# Altium schematic sheet [4]_MOT_POWER.SchDoc
size A3; DocumentNumber: 4; SheetNumber: 4; SheetTotal: 12; Ngu?i ki?m tra: bangdd; Ngu?i thi?t k?: thannt114
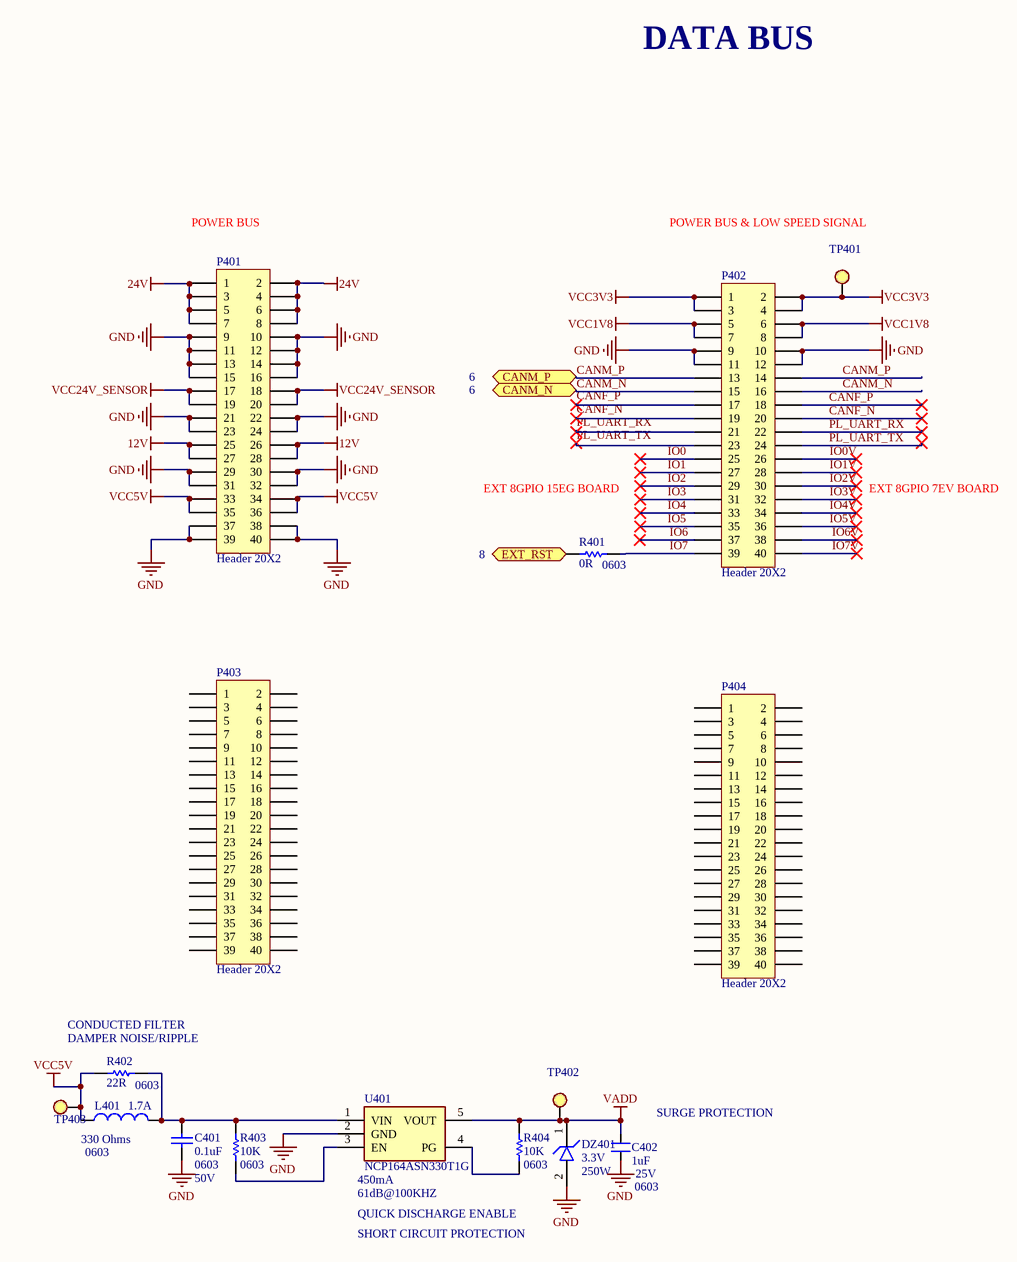
[diagram p0: [4]_MOT_POWER.SchDoc]

## Parts
C401  FOOTPRINT: 0603  Voltage: 50V  [CAP 0603]  (hidden comment: 0.1uF)
C402  PCB FOOTPRINT: 0603  Voltage: 25V  [CAP 0603]  (hidden comment: 1uF)
DZ401  Voltage - Reverse Standoff: 3.3V  Power - Peak Pulse: 250W  [SOD-323]  (hidden comment: ESD8351HT1G)
L401  PCB Footprint: 0603  Current: 1.7A  [FB 0603]  (hidden comment: 330 Ohms)
P401  Header 20X2  [SAMTEC_SSQ-120-03-G-D]
P402  Header 20X2  [SAMTEC_SSQ-120-03-G-D]
P403  Header 20X2  [SAMTEC_SSQ-120-03-G-D]
P404  Header 20X2  [SAMTEC_SSQ-120-03-G-D]
R401  PCB Footprint: 0603  [res 0603]  (hidden comment: 0R)  (no BOM)
R402  PCB Footprint: 0603  [res 0603]  (hidden comment: 22R)
R403  PCB Footprint: 0603  [res 0603]  (hidden comment: 10K)
R404  PCB Footprint: 0603  [res 0603]  (hidden comment: 10K)
TP401  TP SMD  [TESTPOINT]  (value not drawn)  (no BOM)
TP402  TP SMD  [TESTPOINT]  (value not drawn)  (no BOM)
TP403  TP SMD  [TESTPOINT]  (value not drawn)  (no BOM)
U401  NCP164ASN330T1G  CURRENT: 450mA  PSRR: 61dB@100KHZ  [SOT23-5]

## Ports
CANM_N (bidir, see 6), CANM_P (bidir, see 6), EXT_RST (bidir, see 8)

## Nets
12V: P401.25 P401.26 P401.27 P401.28
24V: P401.1 P401.2 P401.3 P401.4 P401.5 P401.6 P401.7 P401.8
GND: C401.1 C402.2 DZ401.2 P401.9 P401.10 P401.11 P401.12 P401.13 P401.14 P401.15 P401.16 P401.21 P401.22 P401.23 P401.24 P401.29 P401.30 P401.31 P401.32 P401.37 P401.38 P401.39 P401.40 P402.9 P402.10 P402.11 P402.12 U401.2(GND)
VADD: C402.1 DZ401.1 R404.1 TP402.1 U401.5(VOUT)
VCC1V8: P402.5 P402.6 P402.7 P402.8
VCC3V3: P402.1 P402.2 P402.3 P402.4 TP401.1
VCC5V: L401.1 P401.33 P401.34 P401.35 P401.36 R402.1 TP403.1
VCC24V_SENSOR: P401.17 P401.18 P401.19 P401.20
CANF_N: P402.19 P402.20
CANF_P: P402.17 P402.18
CANM_N: P402.15 P402.16 ; port CANM_N
CANM_P: P402.13 P402.14 ; port CANM_P
EXT_RST: R401.1 ; port EXT_RST
IO0: P402.25
IO0V: P402.26
IO1: P402.27
IO1V: P402.28
IO2: P402.29
IO2V: P402.30
IO3: P402.31
IO3V: P402.32
IO4: P402.33
IO4V: P402.34
IO5: P402.35
IO5V: P402.36
IO6: P402.37
IO6V: P402.38
IO7: P402.39 R401.2
IO7V: P402.40
PL_UART_RX: P402.21 P402.22
PL_UART_TX: P402.23 P402.24
NetC401_2: C401.2 L401.2 R402.2 R403.1 U401.1(VIN)
NetR403_2: R403.2 U401.3(EN)
NetR404_2: R404.2 U401.4(PG)

Not connected (* = marked no-connect by the designer): P403 1 2 3 4 5 6 7 8 9 10 11 12 13 14 15 16 17 18 19 20 21 22 23 24 25 26 27 28 29 30 31 32 33 34 35 36 37 38 39 40; P404 1 2 3 4 5 6 7 8 9 10 11 12 13 14 15 16 17 18 19 20 21 22 23 24 25 26 27 28 29 30 31 32 33 34 35 36 37 38 39 40

## Notes on the sheet
- DATA BUS
- (near P401) POWER BUS
- POWER BUS & LOW SPEED SIGNAL
- EXT 8GPIO 15EG BOARD
- EXT 8GPIO 7EV BOARD
- (near R402) CONDUCTED FILTER
- (near R402) DAMPER NOISE/RIPPLE
- (near C402) SURGE PROTECTION
- QUICK DISCHARGE ENABLE
- SHORT CIRCUIT PROTECTION

## Library data of the parts
C401 = Cap: CAP-CER,SMD;0.1UF,10%,50V,X7R,0603; MANUFACTURER1: Samsung Electro-Mechanics; MANUFACTURER1_PART#: CL10B104KB8NNNC; MANUFACTURER2_PART#: M0603X104K050TAX; MANUFACTURER1: SS; Unit: PCS; PACKING: Tape & Reel (TR); Process Type: SM; CATEGORY: CAP-CER; VALUE: 0.1uF; Material: X7R; PCB FOOTPRINT: 0603; Tolerance: ±10%; MANUFACTURER2: UWA
C402 = Cap_1uF: CAP CER 1UF 25V X7R 0603; MANUFACTURER1: Samsung Electro-Mechanics; MANUFACTURER1_PART#: CL10A105KA8NNNC; MANUFACTURER2_PART#: TMK107B7105KA-T; PACKING: TR; UNIT: PCS; Material: X5R; Process Type: SM; Tolerance: 10%; Value: 1uF; CATEGORY: CAP CER; PCB_ Footprint: 0603; MANUFACTURER2: Taiyo Yuden; LOH_Code: *
DZ401 = TVS-DIODE;BI-DIR,600W,30V/48.4V,DO214AA,SMBJ30A-E3/52: TVS DIODE 3.3VWM 11.2VC SOD323; MANUFACTURER1: onsemi; Category: TVS; MANUFACTURER1_PART#: ESD8351HT1G; VALUE: ESD8351HT1G; LINK: https://www.digikey.com/en/products/detail/onsemi/ESD8351HT1G/5257577; PRICE: 0.16
L401 = inductor 2.2uF: FERRITE BEAD 330 OHM 0603 1LN; MANUFACTURER1: TDK Corporation; MANUFACTURER1_PART#: MPZ1608S331ATA00; MANUFACTURER2_PART#: BLM18KG331SN1D; PACKING: Tape & Reel (TR); Process Type: SM; Unit: PCS; Tolerance: ±10%; Category: Inductor; DESCRIPTION_: FERRITE BEAD 330 OHM 0603 1LN; MANUFACTURER2: Murata Electronics; Value: 330 Ohms
P401-P404 = Header 20X2: Header, 20-Pin, Dual row; LatestRevisionDate: 17-Jul-2002; LatestRevisionNote: Re-released for DXP Platform.; Publisher: Altium Limited
R401 = Res0.3: RES SMD 0 OHM JUMPER 1/10W 0603; MANUFACTURER1: Yageo; MANUFACTURER1_PART#: RC0603JR-070RL; MANUFACTURER2_PART#: RMCF0603ZT0R00; PACKING: Tape & Reel (TR); Process Type: SM; Unit: PCS; Power: 0.25W; Tolerance: 5%; Value: 0R; CATEGORY: RES SMD; MANUFACTURER2: Stackpole Electronics Inc
R402 = Res0.3: RES 22 OHM 5% 1/10W 0603; MANUFACTURER1: Yageo; MANUFACTURER1_PART#: RC0603JR-0722RL; MANUFACTURER2_PART#: RMCF0603JT22R0; PACKING: Tape & Reel (TR); Process Type: SM; Unit: PCS; Power: 0.25W; Value: 22R; CATEGORY: RES SMD; MANUFACTURER2: Stackpole Electronics Inc; Tolerance: 5%
R403 R404 = Res0.3: RES SMD,10K OHM 5% 1/10W 0603; MANUFACTURER1: Stackpole Electronics Inc; MANUFACTURER1_PART#: RMCF0603JT10K0; MANUFACTURER2_PART#: R0603J10KKDX; PACKING: Tape & Reel (TR); Process Type: SM; Unit: PCS; Power: 0.25W; Value: 10K; CATEGORY: RES-SMD; MANUFACTURER2: UWA; Tolerance: ±5%
TP401-TP403 = TP SMD: TEST POINT
U401 = MIC5504-3.3YM5-TR: LDO 300 MA AD 3.3V ULTRA-LOW NOISE SOT23-5; MANUFACTURER1: onsemi; PROCESS_TYPE: SM; MANUFACTURER1_PART#: NCP164ASN330T1G; Category: IC; VALUE: NCP164ASN330T1G